# Altium schematic sheet [02]Arduino Headers.SchDoc
size A4; Organization: Altium Limited; Address1: L3, 12a Rodborough Rd; Address2: Frenchs Forest; Address3: NSW; Address4: Australia 2086
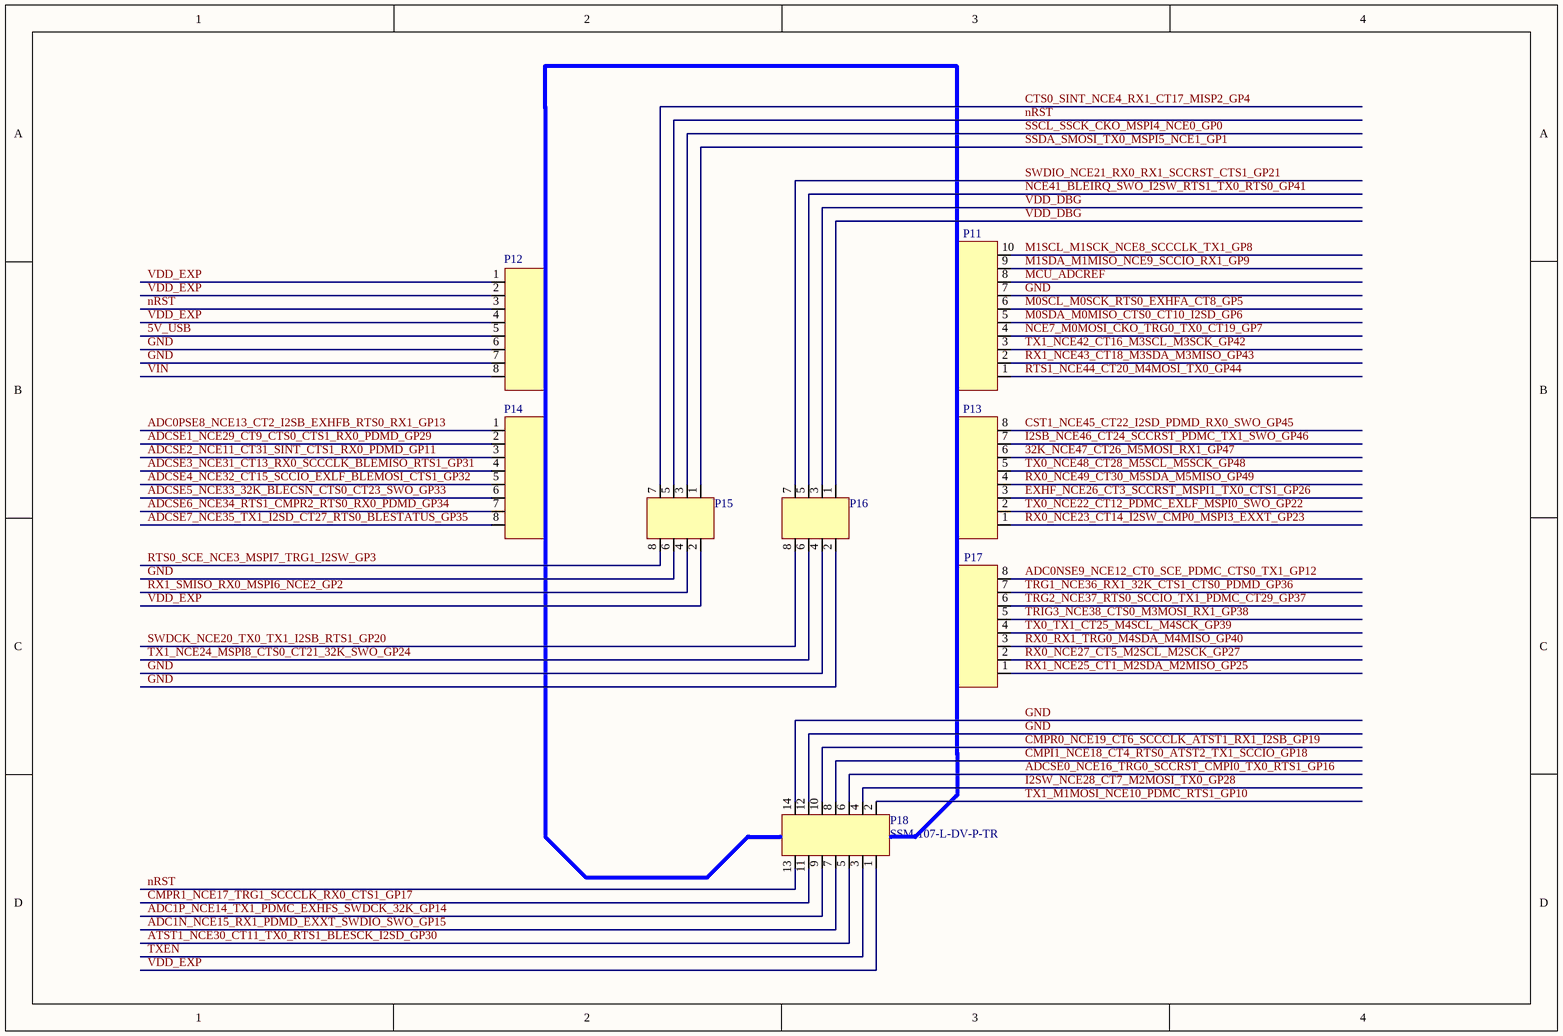
[diagram p0: [02]Arduino Headers.SchDoc]

## Parts
P11  SSM-110-L-SV-P-TR  [SSM-110-L-SV-TR]  (value not drawn)
P12  SSM-108-L-SV-P-TR  [SSM-108-L-SV-TR]  (value not drawn)
P13  SSM-108-L-SV-P-TR  [SSM-108-L-SV-TR]  (value not drawn)
P14  SSM-108-L-SV-P-TR  [SSM-108-L-SV-TR]  (value not drawn)
P15  TSM-104-04-F-DV-P-TR  [TSM-104-04-F-DV-TR]  (value not drawn)
P16  TSM-104-04-F-DV-P-TR  [TSM-104-04-F-DV-TR]  (value not drawn)
P17  SSM-108-L-SV-P-TR  [SSM-108-L-SV-TR]  (value not drawn)
P18  SSM-107-L-DV-P-TR  [SSM-107-L-DV-TR]

## Nets
5V_USB: P12.5
32K_NCE47_CT26_M5MOSI_RX1_GP47: P13.6
ADC0NSE9_NCE12_CT0_SCE_PDMC_CTS0_TX1_GP12: P17.8
ADC0PSE8_NCE13_CT2_I2SB_EXHFB_RTS0_RX1_GP13: P14.1
ADC1N_NCE15_RX1_PDMD_EXXT_SWDIO_SWO_GP15: P18.7
ADC1P_NCE14_TX1_PDMC_EXHFS_SWDCK_32K_GP14: P18.9
ADCSE0_NCE16_TRG0_SCCRST_CMPI0_TX0_RTS1_GP16: P18.6
ADCSE1_NCE29_CT9_CTS0_CTS1_RX0_PDMD_GP29: P14.2
ADCSE2_NCE11_CT31_SINT_CTS1_RX0_PDMD_GP11: P14.3
ADCSE3_NCE31_CT13_RX0_SCCCLK_BLEMISO_RTS1_GP31: P14.4
ADCSE4_NCE32_CT15_SCCIO_EXLF_BLEMOSI_CTS1_GP32: P14.5
ADCSE5_NCE33_32K_BLECSN_CTS0_CT23_SWO_GP33: P14.6
ADCSE6_NCE34_RTS1_CMPR2_RTS0_RX0_PDMD_GP34: P14.7
ADCSE7_NCE35_TX1_I2SD_CT27_RTS0_BLESTATUS_GP35: P14.8
ATST1_NCE30_CT11_TX0_RTS1_BLESCK_I2SD_GP30: P18.5
CMPI1_NCE18_CT4_RTS0_ATST2_TX1_SCCIO_GP18: P18.8
CMPR0_NCE19_CT6_SCCCLK_ATST1_RX1_I2SB_GP19: P18.10
CMPR1_NCE17_TRG1_SCCCLK_RX0_CTS1_GP17: P18.11
CST1_NCE45_CT22_I2SD_PDMD_RX0_SWO_GP45: P13.8
CTS0_SINT_NCE4_RX1_CT17_MISP2_GP4: P15.7
EXHF_NCE26_CT3_SCCRST_MSPI1_TX0_CTS1_GP26: P13.3
GND: P11.7 P12.6 P12.7 P15.6 P16.2 P16.4 P18.12 P18.14
I2SB_NCE46_CT24_SCCRST_PDMC_TX1_SWO_GP46: P13.7
I2SW_NCE28_CT7_M2MOSI_TX0_GP28: P18.4
M0SCL_M0SCK_RTS0_EXHFA_CT8_GP5: P11.6
M0SDA_M0MISO_CTS0_CT10_I2SD_GP6: P11.5
M1SCL_M1SCK_NCE8_SCCCLK_TX1_GP8: P11.10
M1SDA_M1MISO_NCE9_SCCIO_RX1_GP9: P11.9
MCU_ADCREF: P11.8
NCE7_M0MOSI_CKO_TRG0_TX0_CT19_GP7: P11.4
NCE41_BLEIRQ_SWO_I2SW_RTS1_TX0_RTS0_GP41: P16.5
nRST: P12.3 P15.5 P18.13
RTS0_SCE_NCE3_MSPI7_TRG1_I2SW_GP3: P15.8
RTS1_NCE44_CT20_M4MOSI_TX0_GP44: P11.1
RX0_NCE23_CT14_I2SW_CMP0_MSPI3_EXXT_GP23: P13.1
RX0_NCE27_CT5_M2SCL_M2SCK_GP27: P17.2
RX0_NCE49_CT30_M5SDA_M5MISO_GP49: P13.4
RX0_RX1_TRG0_M4SDA_M4MISO_GP40: P17.3
RX1_NCE25_CT1_M2SDA_M2MISO_GP25: P17.1
RX1_NCE43_CT18_M3SDA_M3MISO_GP43: P11.2
RX1_SMISO_RX0_MSPI6_NCE2_GP2: P15.4
SSCL_SSCK_CKO_MSPI4_NCE0_GP0: P15.3
SSDA_SMOSI_TX0_MSPI5_NCE1_GP1: P15.1
SWDCK_NCE20_TX0_TX1_I2SB_RTS1_GP20: P16.8
SWDIO_NCE21_RX0_RX1_SCCRST_CTS1_GP21: P16.7
TRG1_NCE36_RX1_32K_CTS1_CTS0_PDMD_GP36: P17.7
TRG2_NCE37_RTS0_SCCIO_TX1_PDMC_CT29_GP37: P17.6
TRIG3_NCE38_CTS0_M3MOSI_RX1_GP38: P17.5
TX0_NCE22_CT12_PDMC_EXLF_MSPI0_SWO_GP22: P13.2
TX0_NCE48_CT28_M5SCL_M5SCK_GP48: P13.5
TX0_TX1_CT25_M4SCL_M4SCK_GP39: P17.4
TX1_M1MOSI_NCE10_PDMC_RTS1_GP10: P18.2
TX1_NCE24_MSPI8_CTS0_CT21_32K_SWO_GP24: P16.6
TX1_NCE42_CT16_M3SCL_M3SCK_GP42: P11.3
TXEN: P18.3
VDD_DBG: P16.1 P16.3
VDD_EXP: P12.1 P12.2 P12.4 P15.2 P18.1
VIN: P12.8

## Notes on the sheet
- Title
- Size:
- Date:
- A3
- Number:
- Time:
- Revision:
- Sheet
- of
- File:

## Library data of the parts
P11 = SSM-110-L-SV-P-TR: 10 Position Receptacle, Pass Through Connector 2.54mm Gold SMD
P12-P14 P17 = SSM-108-L-SV-P-TR: 8 Position Receptacle, Pass Through Connector 2.54mm Gold SMD
P15 P16 = TSM-104-04-F-DV-P-TR: 8 Positions Header, 2 Row,Gold, Unshrouded Connector 2.54mm SMD
P18 = SSM-107-L-DV-P-TR: 14 Positions Socket Strip, Double Row Vertical 2,54mm SMD